# EAGLE design Sensly_HAT v1.6 (EAGLE 9.1.0)
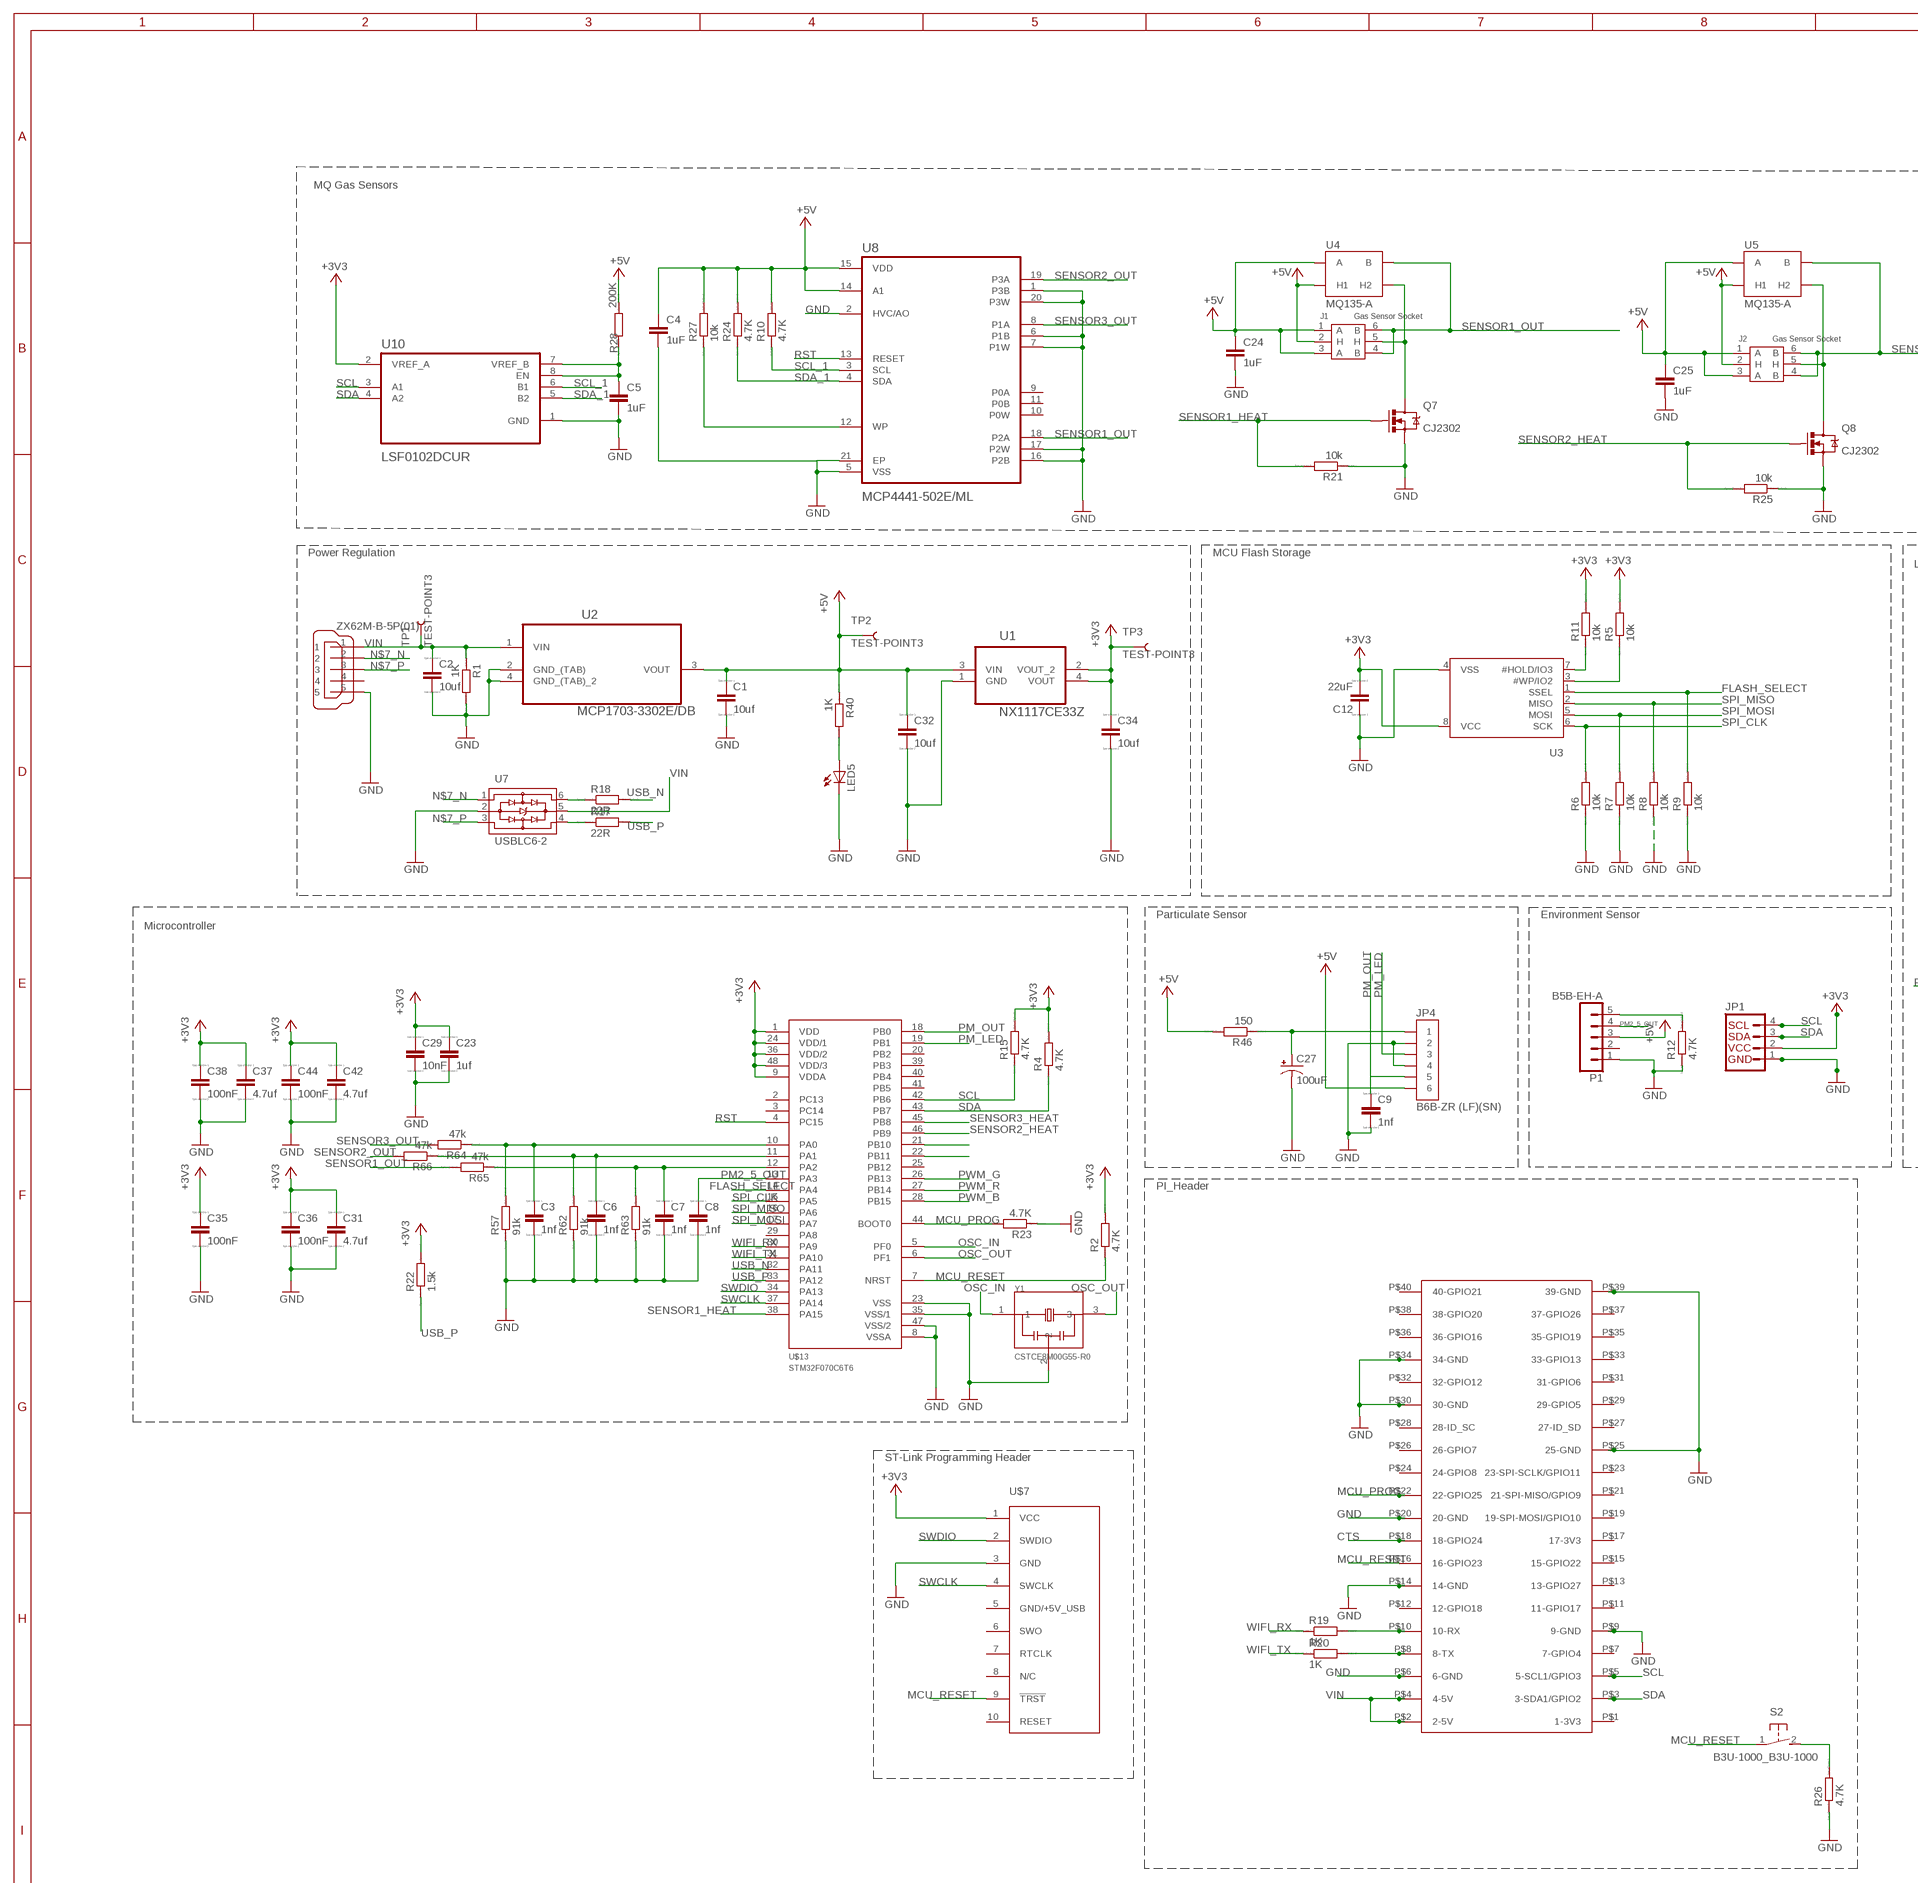
[diagram p0: schematic, sheet 1, part 1 of 2]
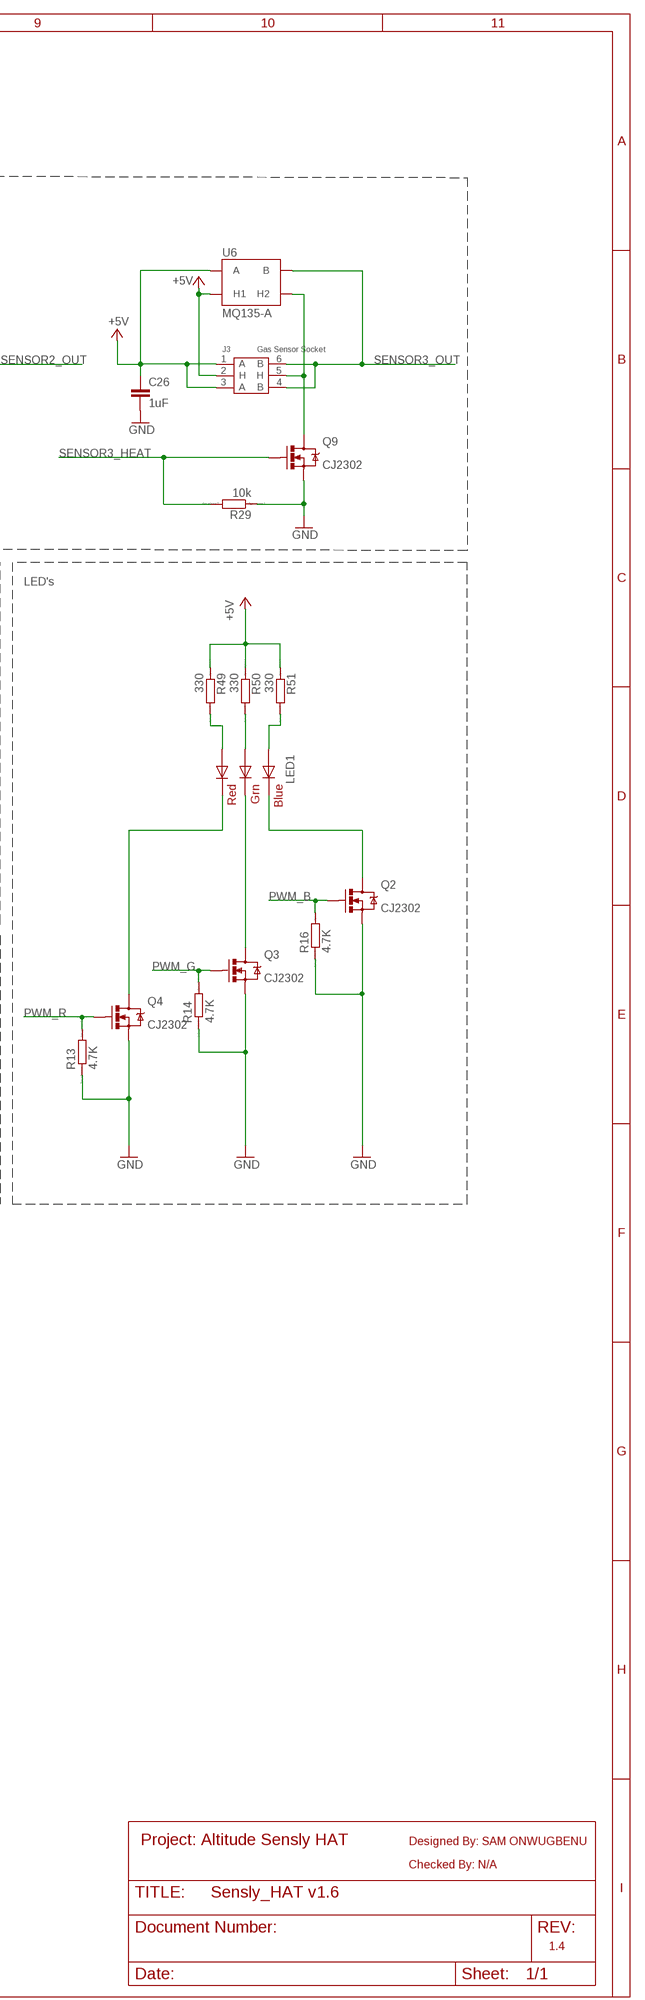
[diagram p1: schematic, sheet 1, part 2 of 2]

## Parts
C1  10uf  CC0603  [C0603]
C2  10uf  CC0603  [C0603]
C3  1nf  EAGLE-LTSPICE_CC0402  [EAGLE-LTSPICE_C0402]
C4  1uF  C0603  [0603_N]
C5  1uF  C0603  [0603_N]
C6  1nf  EAGLE-LTSPICE_CC0402  [EAGLE-LTSPICE_C0402]
C7  1nf  EAGLE-LTSPICE_CC0402  [EAGLE-LTSPICE_C0402]
C8  1nf  EAGLE-LTSPICE_CC0402  [EAGLE-LTSPICE_C0402]
C9  1nf  EAGLE-LTSPICE_CC0402  [EAGLE-LTSPICE_C0402]
C12  22uF  CC0603  [C0603]
C23  1uf  CC0603  [C0603]
C24  1uF  C0603  [0603_N]
C25  1uF  C0603  [0603_N]
C26  1uF  C0603  [0603_N]
C27  100uF  CAP_POL1206  [EIA3216]
C29  10nF  CC0603  [C0603]
C31  4.7uf  CC0603  [C0603]
C32  10uf  CC0603  [C0603]
C34  10uf  CC0603  [C0603]
C35  100nF  CC0603  [C0603]
C36  100nF  CC0603  [C0603]
C37  4.7uf  CC0603  [C0603]
C38  100nF  CC0603  [C0603]
C42  4.7uf  CC0603  [C0603]
C44  100nF  CC0603  [C0603]
J1  Gas Sensor Socket  MQ-SOCKET  [6P-D17.6X9.8H]
J2  Gas Sensor Socket  MQ-SOCKET  [6P-D17.6X9.8H]
J3  Gas Sensor Socket  MQ-SOCKET  [6P-D17.6X9.8H]
JP1  I2C_STANDARD  [1X04]
JP4  B6B-ZR (LF)(SN)  CONNECTOR_6X1-ZR-THT  [CONNECTOR_B6B-ZR]
LED1  RGBLED5050  [RGBLED5050]
LED5  LEDCHIPLED_0603  [CHIPLED_0603]
P1  B5B-EH-A  [B5B-EH-A]
Q2  CJ2302  MOSFET_N_SOT23-3  [SOT-23-3_N/SSOT-3_N]
Q3  CJ2302  MOSFET_N_SOT23-3  [SOT-23-3_N/SSOT-3_N]
Q4  CJ2302  MOSFET_N_SOT23-3  [SOT-23-3_N/SSOT-3_N]
Q7  CJ2302  MOSFET_N_SOT23-3  [SOT-23-3_N/SSOT-3_N]
Q8  CJ2302  MOSFET_N_SOT23-3  [SOT-23-3_N/SSOT-3_N]
Q9  CJ2302  MOSFET_N_SOT23-3  [SOT-23-3_N/SSOT-3_N]
R1  1K  RR0603  [R0603]
R2  4.7K  RR0603  [R0603]
R4  4.7K  RR0603  [R0603]
R5  10k  RR0603  [R0603]
R6  10k  RR0603  [R0603]
R7  10k  RR0603  [R0603]
R8  10k  RR0603  [R0603]
R9  10k  RR0603  [R0603]
R10  4.7K  RR0603  [R0603]
R11  10k  RR0603  [R0603]
R12  4.7K  RR0603  [R0603]
R13  4.7K  RR0603  [R0603]
R14  4.7K  RR0603  [R0603]
R15  4.7K  RR0603  [R0603]
R16  4.7K  RR0603  [R0603]
R17  22R  RR0603  [R0603]
R18  22R  RR0603  [R0603]
R19  1K  RR0603  [R0603]
R20  1K  RR0603  [R0603]
R21  10k  RR0603  [R0603]
R22  1.5k  RR0603  [R0603]
R23  4.7K  RR0603  [R0603]
R24  4.7K  RR0603  [R0603]
R25  10k  RR0603  [R0603]
R26  4.7K  RR0603  [R0603]
R27  10k  RR0603  [R0603]
R28  200K  RR0603  [R0603]
R29  10k  RR0603  [R0603]
R40  1K  RR0603  [R0603]
R46  150  RR0603  [R0603]
R49  330  RR0603  [R0603]
R50  330  RR0603  [R0603]
R51  330  RR0603  [R0603]
R57  91k  RR0603  [R0603]
R62  91k  RR0603  [R0603]
R63  91k  RR0603  [R0603]
R64  47k  RR0603  [R0603]
R65  47k  RR0603  [R0603]
R66  47k  RR0603  [R0603]
S2  B3U-1000_B3U-1000  [B3U-1000_B3U]
TP1  TEST-POINT3  [PAD.03X.03]
TP2  TEST-POINT3  [PAD.03X.03]
TP3  TEST-POINT3  [PAD.03X.03]
U1  NX1117CE33Z  [SOT230P700X180-4N]
U2  MCP1703-3302E/DB  [SOT230P700X180-4N]
U3  SPIFLASH_SOIC8  [SOIC8_150MIL]
U4  MQ135-A  [MQ135-A]
U5  MQ135-A  [MQ135-A]
U6  MQ135-A  [MQ135-A]
U7  USBLC6-2  [USBLC6-2P6]
U8  MCP4441-502E/ML  [QFN50P400X400X100-21N]
U10  LSF0102DCUR  [SOP50P310X90-8N]
U$2  RASPBERRY-PI+  [RASPBERRY-PI-PLUS-CAM_NOTCH]
U$7  TC2050-MCP-NL  [TC2030-MCP-NL]
U$9  ZX62M-B-5P(01)  [MICROUSB]
U$13  STM32F070C6T6  [QFP50P900X900X160-48N]
Y1  CSTCE8M00G55-R0  [OSC_CSTCE8M00G55-R0]

## Nets
+3V3: C12.2 C23.1 C29.1 C31.1 C34.1 C35.1 C36.1 C37.1 C38.1 C42.1 C44.1 JP1.2 R2.2 R4.2 R5.2 R11.2 R15.2 R22.2 TP3.P$1 U1.2(VOUT_2) U1.4(VOUT) U3.8(VCC) U10.2(VREF_A) U$7.1(VCC) U$13.1(VDD) U$13.9(VDDA) U$13.24(VDD/1) U$13.36(VDD/2) U$13.48(VDD/3)
+5V: C1.1 C4.1 C24.1 C25.1 C26.1 C32.1 J1.1(A) J1.2(H) J1.3(A) J2.1(A) J2.2(H) J2.3(A) J3.1(A) J3.2(H) J3.3(A) JP4.P$6 P1.3 R10.2 R24.2 R27.2 R28.2 R40.1 R46.2 R49.1 R50.1 R51.1 TP2.P$1 U1.3(VIN) U2.3(VOUT) U4.1(A) U4.2(H1) U4.3(A) U5.1(A) U5.2(H1) U5.3(A) U6.1(A) U6.2(H1) U6.3(A) U8.14(A1) U8.15(VDD)
CTS: U$2.P$18(18-GPIO24)
FLASH_SELECT: R9.2 U3.1(SSEL) U$13.14(PA4)
GND: C1.2 C2.2 C3.2 C4.2 C5.2 C6.2 C7.2 C8.2 C9.2 C12.1 C23.2 C24.2 C25.2 C26.2 C27.C(-) C29.2 C31.2 C32.2 C34.2 C35.2 C36.2 C37.2 C38.2 C42.2 C44.2 JP1.1 JP4.P$2 JP4.P$4 LED5.C P1.1 Q2.2(S) Q3.2(S) Q4.2(S) Q7.2(S) Q8.2(S) Q9.2(S) R1.2 R6.1 R7.1 R8.1 R9.1 R12.1 R13.1 R14.1 R16.1 R21.1 R23.1 R25.1 R26.1 R29.1 R57.1 R62.1 R63.1 U1.1(GND) U2.2(GND_(TAB)) U2.4(GND_(TAB)_2) U3.4(VSS) U7.2 U8.1(P3B) U8.2(HVC/AO) U8.5(VSS) U8.6(P1B) U8.7(P1W) U8.16(P2B) U8.17(P2W) U8.20(P3W) U8.21(EP) U10.1(GND) U$2.P$6(6-GND) U$2.P$9(9-GND) U$2.P$14(14-GND) U$2.P$20(20-GND) U$2.P$25(25-GND) U$2.P$30(30-GND) U$2.P$34(34-GND) U$2.P$39(39-GND) U$7.3(GND) U$9.5 U$13.8(VSSA) U$13.23(VSS) U$13.35(VSS/1) U$13.47(VSS/2) Y1.2
MCU_PROG: R23.2 U$2.P$22(22-GPIO25) U$13.44(BOOT0)
MCU_RESET: R2.1 S2.1 U$2.P$16(16-GPIO23) U$7.9(!TRST) U$13.7(NRST)
N$1: LED1.5(RED_C) Q4.3(D)
N$2: U$13.21(PB10)
N$3: U$13.22(PB11)
N$4: LED5.A R40.2
N$5: P1.5 R12.2
N$6: R26.2 S2.2
N$7_N: U7.1 U$9.2
N$7_P: U7.3 U$9.3
N$8: R19.2 U$2.P$10(10-RX)
N$9: R20.2 U$2.P$8(8-TX)
N$10: R27.1 U8.12(WP)
N$11: R5.1 U3.3(#WP/IO2)
N$12: C5.1 R28.1 U10.7(VREF_B) U10.8(EN)
N$12_N: R18.1 U7.6
N$12_P: R17.1 U7.4
N$13: R11.1 U3.7(#HOLD/IO3)
N$14: LED1.4(BLUE_C) Q2.3(D)
N$27: J1.5(H) Q7.3(D) U4.5(H2)
N$29: LED1.6(GREEN_C) Q3.3(D)
N$30: J2.5(H) Q8.3(D) U5.5(H2)
N$33: J3.5(H) Q9.3(D) U6.5(H2)
N$38: C27.A(+) JP4.P$1 R46.1
N$40: LED1.1(GREEN_A) R50.2
N$52: LED1.3(BLUE_A) R51.2
N$53: LED1.2(RED_A) R49.2
OSC_IN: U$13.5(PF0) Y1.1
OSC_OUT: U$13.6(PF1) Y1.3
PM2_5_OUT: C8.1 P1.4 U$13.13(PA3)
PM_LED: JP4.P$3 U$13.19(PB1)
PM_OUT: C9.1 JP4.P$5 U$13.18(PB0)
PWM_B: Q2.1(G) R16.2 U$13.28(PB15)
PWM_G: Q3.1(G) R14.2 U$13.26(PB13)
PWM_R: Q4.1(G) R13.2 U$13.27(PB14)
RST: U8.13(RESET) U$13.4(PC15)
SCL: JP1.4 R15.1 U10.3(A1) U$2.P$5(5-SCL1/GPIO3) U$13.42(PB6)
SCL_1: R10.1 U8.3(SCL) U10.6(B1)
SDA: JP1.3 R4.1 U10.4(A2) U$2.P$3(3-SDA1/GPIO2) U$13.43(PB7)
SDA_1: R24.1 U8.4(SDA) U10.5(B2)
SENSOR1_HEAT: Q7.1(G) R21.2 U$13.38(PA15)
SENSOR1_OUT: J1.4(B) J1.6(B) R65.2 U4.4(B) U4.6(B) U8.18(P2A)
SENSOR1_OUT1: C7.1 R63.2 R65.1 U$13.12(PA2)
SENSOR2_HEAT: Q8.1(G) R25.2 U$13.46(PB9)
SENSOR2_OUT: J2.4(B) J2.6(B) R66.2 U5.4(B) U5.6(B) U8.19(P3A)
SENSOR2_OUT1: C6.1 R62.2 R66.1 U$13.11(PA1)
SENSOR3_HEAT: Q9.1(G) R29.2 U$13.45(PB8)
SENSOR3_OUT: J3.4(B) J3.6(B) R64.2 U6.4(B) U6.6(B) U8.8(P1A)
SENSOR3_OUT1: C3.1 R57.2 R64.1 U$13.10(PA0)
SPI_CLK: R6.2 U3.6(SCK) U$13.15(PA5)
SPI_MISO: R8.2 U3.2(MISO) U$13.16(PA6)
SPI_MOSI: R7.2 U3.5(MOSI) U$13.17(PA7)
SWCLK: U$7.4(SWCLK) U$13.37(PA14)
SWDIO: U$7.2(SWDIO) U$13.34(PA13)
USB_N: R18.2 U$13.32(PA11)
USB_P: R17.2 R22.1 U$13.33(PA12)
VIN: C2.1 R1.1 TP1.P$1 U2.1(VIN) U7.5 U$2.P$2(2-5V) U$2.P$4(4-5V) U$9.1
WIFI_RX: R19.1 U$13.30(PA9)
WIFI_TX: R20.1 U$13.31(PA10)
Unconnected: P1.2 U8.9(P0A) U8.10(P0W) U8.11(P0B) U$2.P$1(1-3V3) U$2.P$7(7-GPIO4) U$2.P$11(11-GPIO17) U$2.P$12(12-GPIO18) U$2.P$13(13-GPIO27) U$2.P$15(15-GPIO22) U$2.P$17(17-3V3) U$2.P$19(19-SPI-MOSI/GPIO10) U$2.P$21(21-SPI-MISO/GPIO9) U$2.P$23(23-SPI-SCLK/GPIO11) U$2.P$24(24-GPIO8) U$2.P$26(26-GPIO7) U$2.P$27(27-ID_SD) U$2.P$28(28-ID_SC) U$2.P$29(29-GPIO5) U$2.P$31(31-GPIO6) U$2.P$32(32-GPIO12) U$2.P$33(33-GPIO13) U$2.P$35(35-GPIO19) U$2.P$36(36-GPIO16) U$2.P$37(37-GPIO26) U$2.P$38(38-GPIO20) U$2.P$40(40-GPIO21) U$7.5(GND/+5V_USB) U$7.6(SWO) U$7.7(RTCLK) U$7.8(N/C) U$7.10(RESET) U$9.4 U$13.2(PC13) U$13.3(PC14) U$13.20(PB2) U$13.25(PB12) U$13.29(PA8) U$13.39(PB3) U$13.40(PB4) U$13.41(PB5)

## Notes on the sheet
- MQ Gas Sensors
- Power Regulation | MCU Flash Storage
- LED's
- Particulate Sensor | Environment Sensor
- Microcontroller
- PI_Header
- ST-Link Programming Header
- Project: Altitude Sensly HAT | Designed By: SAM ONWUGBENU
- Checked By: N/A
- 1.4

## Library data of the parts
C1 C2 C12 C23 C29 C31 C32 C34-C38 C42 C44 = eagle-ltspice:C: CAPACITOR, European symbol; SPICEMODEL: NONE; SPICEPREFIX: C
C3 C6-C9 = pianywhere 4g:EAGLE-LTSPICE_C: CAPACITOR, European symbol; SPICEMODEL: NONE; SPICEPREFIX: C
C4 C5 C24-C26 = Xevelabs:C: Non-polarized Capacitor
C27 = SparkFun:CAP_POL: Capacitor Polarized These are standard SMD and PTH capacitors. Normally 10uF, 47uF, and 100uF in electrolytic and tantalum varieties. Always verify the external diameter of the through hole cap, it varies with capacity, voltage, and manufacturer. The EIA devices should be standard.
J1-J3 = template:MQ-SOCKET
JP1 = SparkFun-Connectors:I2C_STANDARD: SparkFun has standardized on a pinout for all I2C based sensor breakouts. This pinout allows I2C boards to be plugged directly into the headers on Arduino Uno compatible boards, and to be daisy chained easily.
JP4 = AirQuality-sensors:CONNECTOR_6X1
LED1 = adafruit:RGBLED: For 5050 RGB LEDs, the order of the LEDs may vary from one manufacturer to another!
LED5 = adafruit:LED: LED OSRAM: - CHIPLED LG R971, LG N971, LY N971, LG Q971, LY Q971, LO R971, LY R971 LH N974, LH R974 LS Q976, LO Q976, LY Q976 LO Q996 - Hyper CHIPLED LW Q18S LB Q993, LB Q99A, LB R99A - SideLED LS A670, LO A670, LY A670, LG A670, LP A670 LB A673, LV A673, LT A673, LW A673 LH A674 LY A675 LS A676, LA A676, LO A676, LY A676, LW A676 LS A679, LY A679, LG A679 - Hyper Micro SIDELED® LS Y876, LA Y876, LO Y876, LY Y876 LT Y87S - SmartLED LW L88C, LW L88S LB L89C, LB L89S, LG L890 LS L89K, LO L89K, LY L89K LS L896, LA L896, LO L896, LY L896 - TOPLED LS T670, LO T670, LY T670, LG T670, LP T670 LSG T670, LSP T670, LSY T670, LOP T670, LYG T670 LG T671, LOG T671, LSG T671 LB T673, LV T673, LT T673, LW T673 LH T674 LS T676, LA T676, LO T676, LY T676, LB T676, LH T676, LSB T676, LW T676 LB T67C, LV T67C, LT T67C, LS T67K, LO T67K, LY T67K, LW E67C LS E67B, LA E67B, LO E67B, LY E67B, LB E67C, LV E67C, LT E67C LW T67C LS T679, LY T679, LG T679 LS T770, LO T770, LY T770, LG T770, LP T770 LB T773, LV T773, LT T773, LW T773 LH T774 LS E675, LA E675, LY E675, LS T675 LS T776, LA T776, LO T776, LY T776, LB T776 LHGB T686 LT T68C, LB T68C - Hyper Mini TOPLED® LB M676 - Mini TOPLED Santana® LG M470 LS M47K, LO M47K, LY M47K Source: http://www.osram.convergy.de/
P1 = con-jst-eh:B5B-EH-A: HEADER
Q2-Q4 Q7-Q9 = Xevelabs:MOSFET_N
R1 R2 R4-R29 R40 R46 R49-R51 R57 R62-R66 = eagle-ltspice:R: RESISTOR, European symbol; SPICEMODEL: NONE; SPICEPREFIX: R
S2 = pianywhere 4g:B3U-1000_B3U-1000: Omron B3U-1000 SMD tact switch
TP1-TP3 = SparkFun-Passives:TEST-POINT: Bare copper test points for troubleshooting or ICT
U1 = sensly:NX1117CE33Z: LDO, FIXED, 3.3V, 1.25%, SOT-223-4; MPN: NX1117CE33Z; OC_FARNELL: 2057285; OC_NEWARK: unknown; PACKAGE: SOT-223-4; SUPPLIER: NXP
U2 = Microchip_By_element14_Batch_1:MCP1703-3302E/DB: IC REG LDO 3.3V 250MA; MPN: MCP1703-3302E/DB; OC_FARNELL: 1627177; OC_NEWARK: 40M0623; PACKAGE: SOT-223-3; SUPPLIER: Microchip
U3 = microbuilder:SPIFLASH_SOIC8: SOIC8 SPI Flash Be careful with the size since SOIC8 flash comes in several 'widths' SOIC8 150 mil M25P16 - 16Mbit (2Mbit x 8) Serial Flash (75MHz SPI Bus), Supply: 2.7-3.6V Digikey: SOIC8 - M25P16-VMN6P-ND SOIC8 208 mil W25Q16BVSSIG - 16Mbit (2Mbit x 8) Serial Flash (104MHz SPI Bus), Supply: 2.7-3.6V Digikey: SOIC8 - W25Q16BVSSIG-ND
U4-U6 = AirQuality-sensors:MQ135: MQ135 gas sensor
U7 = USBLC6-2:USBLC6-2; AVAILABILITY: Unavailable; DESCRIPTION: Very Low Capacitance Esd Protection; MF: STMicroelectronics; MP: USBLC6-2; PACKAGE: None; PRICE: None
U8 = MCP4441-502E_ML:MCP4441-502E/ML: None; AVAILABILITY: Warning; DESCRIPTION: MCP4441 Series Quad 7-Bit 129 Step I2C 5 kOhm Non Volatile Digital POT-QFN-20; MF: Microchip; MP: MCP4441-502E/ML; PACKAGE: QFN-20 Microchip; PRICE: 1.26 USD
U10 = LSF0102DCUR:LSF0102DCUR: None; AVAILABILITY: Good; DESCRIPTION: Dual Bidirectional Multi-Voltage Level Translator 8-US8 -40 to 125; MF: Texas Instruments; MP: LSF0102DCUR; PACKAGE: VFSOP-8 Texas Instruments; PRICE: 0.36 USD
U$2 = rpi-samtac:RASPBERRY-PI+: Samtec SSW-120-01-T-D
U$7 = TAG-Connect-TC2050-IDC-NL-SWD-Mode:TC2050: TAG-CONNECT ISP Connector Manufacturer: Tag-Connect <www.tag-connect.com> Cable for easy In-Circuit PCB Programming. Designed for JTAG 10 pin, suitable for many others. Pin Connection for TC2050 NL. PAD Description 1 VTREF 2 TMS 3 GND 4 TCK 5 NC 6 TDO 7 RTCK 8 TDI 9 !TRST 10 RESET ©2009 ROFA.cz Modified 7/2011 by Tim McCarthy-Smith VIDA Products INC
U$9 = usb:ZX62M-B-5P(01); FARNELL: 2427876
U$13 = STM32F070C6T6:STM32F070C6T6
Y1 = CSTCE8M00G55-R0:CSTCE8M00G55-R0: SMD Crystal 8MHz -0.3%-150R; AVAILABILITY: Good; DESCRIPTION: Ceramic Resonator 8MHz ??0.5% (Tol) ??0.2% (Stability) 33pF 40Ohm 3-Pin CSMD T/R; MF: Murata; MP: CSTCE8M00G55-R0; PACKAGE: SMD-3 Murata; PRICE: 0.27 USD

## Board
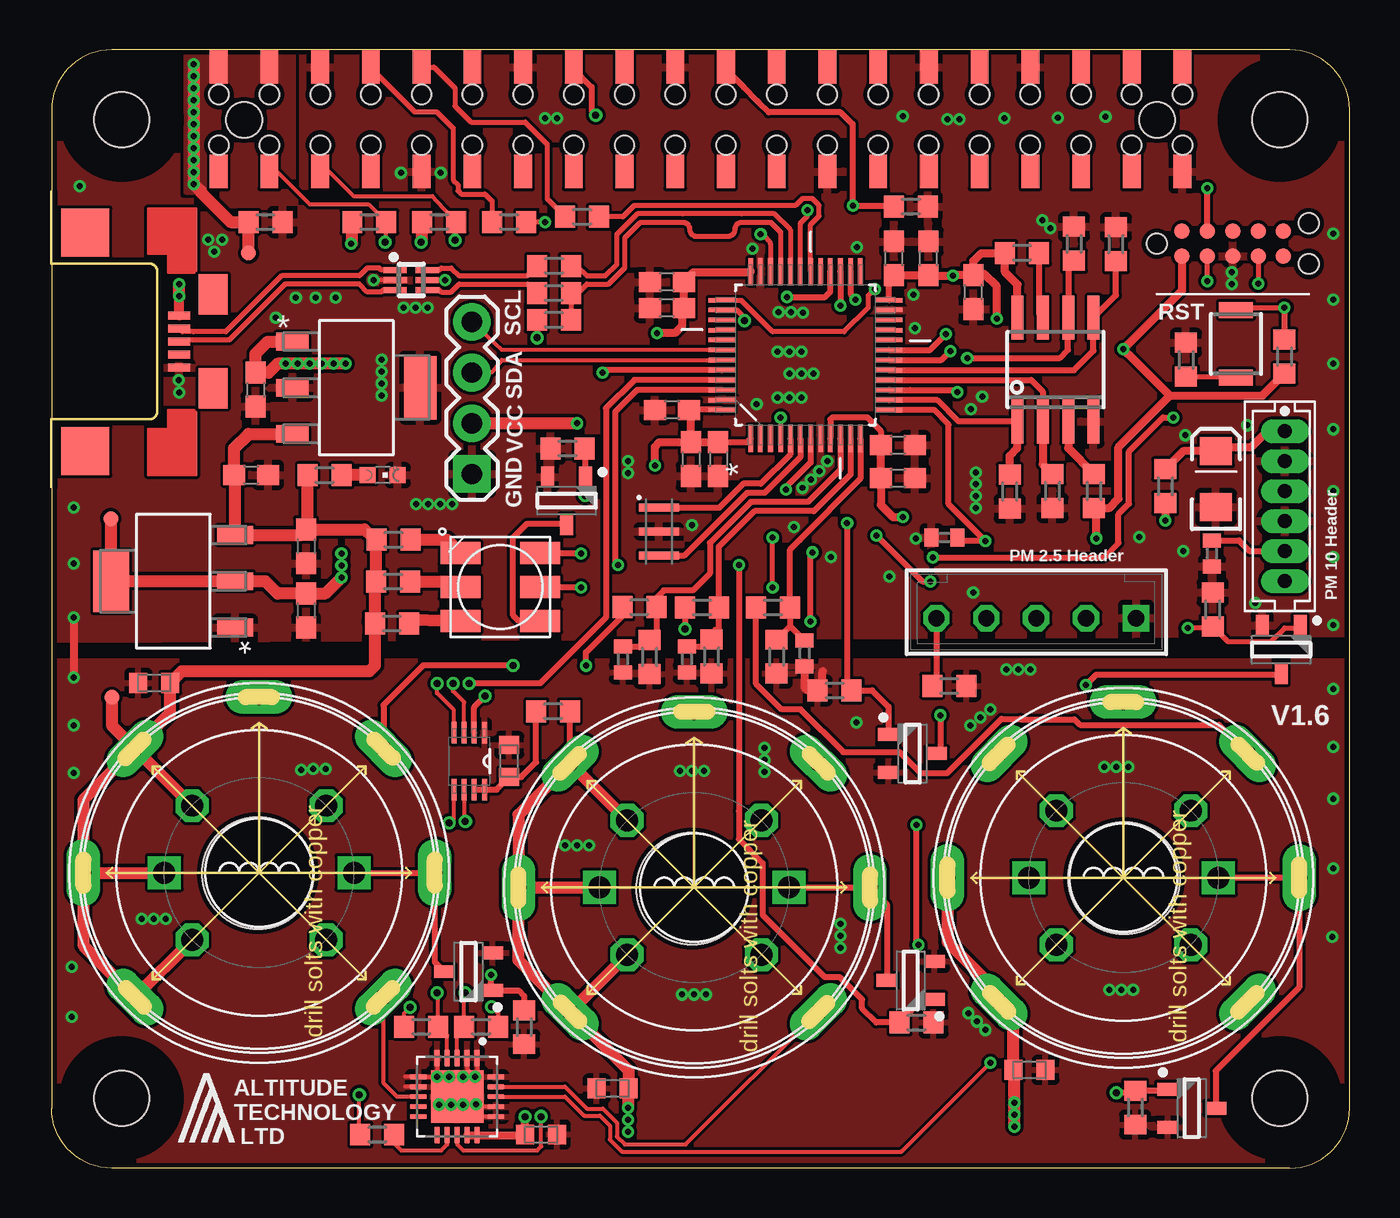
[diagram p2: board, top side]
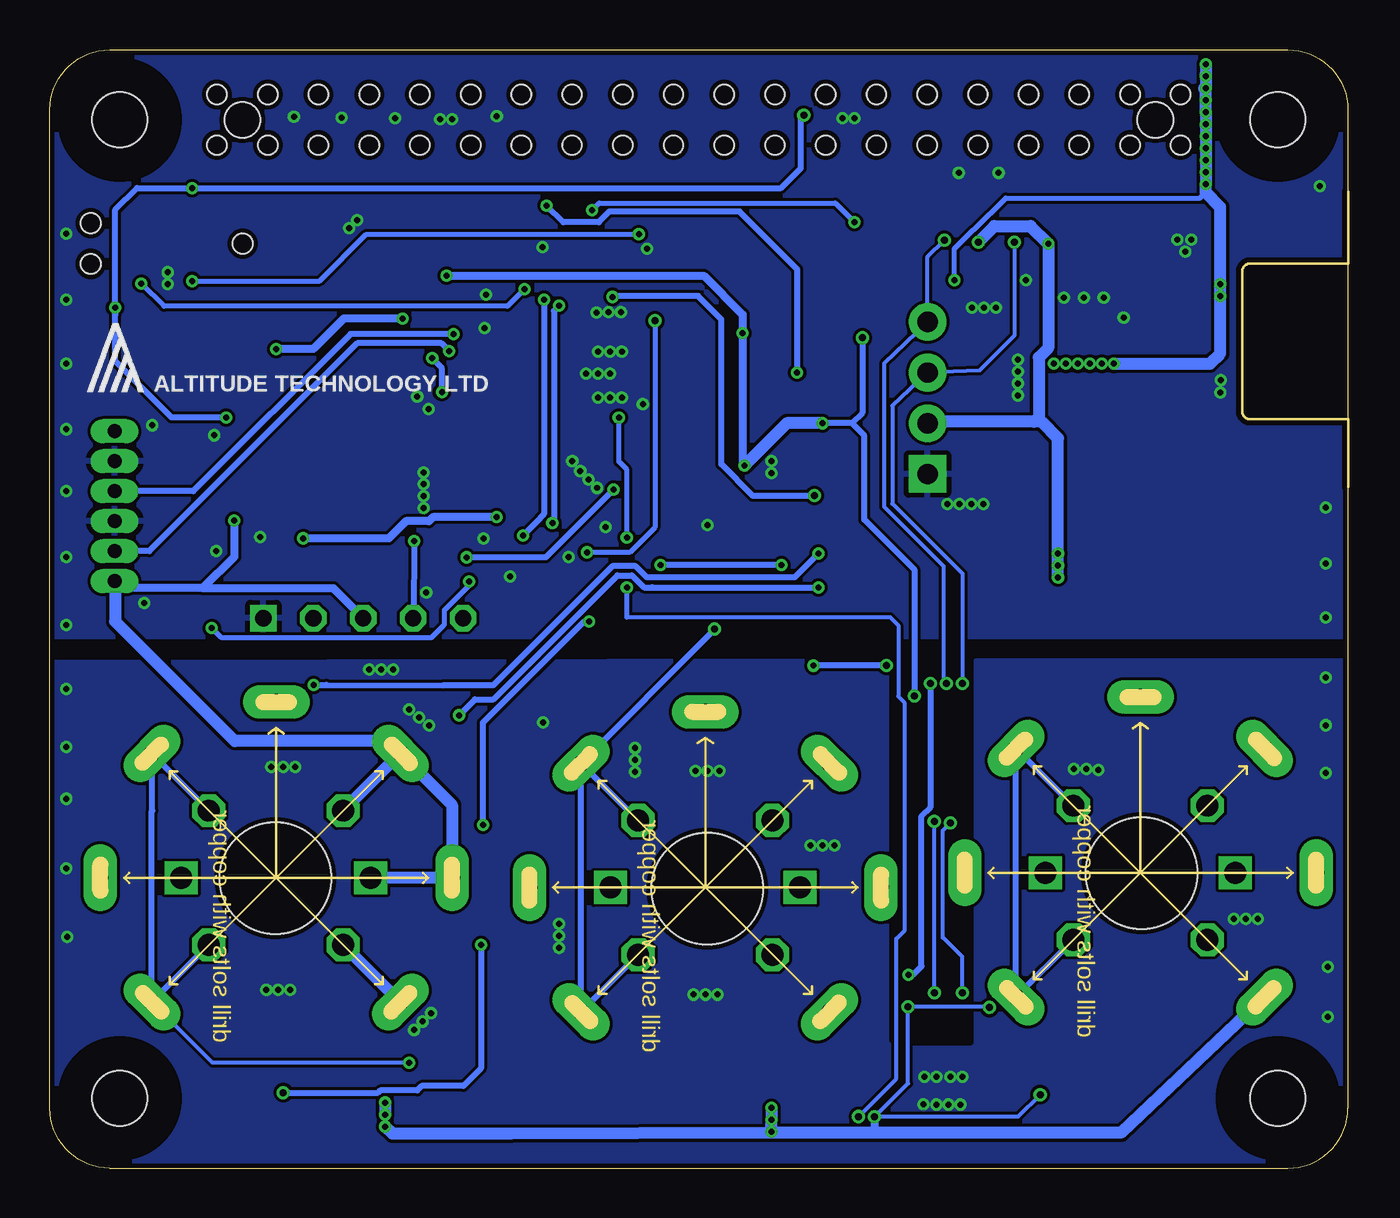
[diagram p3: board, bottom side, seen from below]

Size 65.01 x 56 mm. Coordinates in mm from the lower left corner, seen from the top.
Copper layers (1*16): Top 0.035mm / dielectric 1.5mm / Bottom 0.035mm
Design rules "SeeedStudio_2layer_DRU_no_angle_20140221 *": minimum track width 6mil, minimum drill 0.3mm, track to track 6mil, track to pad 6mil, pad to pad 6mil, via to via 6mil, smd to smd 0mil, copper to edge 10mil, drill to drill 10mil, minimum pad ring 10mil, minimum via ring 6mil, stop-mask expansion 2mil, vias tented up to drill 100mil, thermal gap 10mil
Holes 5.58 mm at 53.71,14.52 32.09,13.99 10.34,14.78

### Footprints (pad centres in the part's own frame; a part is rotated, then mirrored left to right if it is on the bottom)
C0603 = smd 1.1 x 1: 1 -0.85,0; 2 0.85,0
EAGLE-LTSPICE_C0402 = smd 0.7 x 0.9: 1 -0.65,0; 2 0.65,0
0603_N = smd 0.9 x 1: 1 -0.8,0; 2 0.8,0
EIA3216 = smd 1.4 x 1.6: A 1.4,0; C -1.4,0
6P-D17.6X9.8H = drill 0.8 pad 1.676 long: 1 -6.223,6.223; 2 0,8.8; 3 6.223,6.223; 4 6.223,-6.223; 5 0,-8.8; 6 -6.223,-6.223; 7 8.8,0
1X04 = drill 1.016 pad 1.88 square: 1 0,0 | drill 1.016 pad 1.88: 2 2.54,0; 3 5.08,0; 4 7.62,0
CONNECTOR_B6B-ZR = drill 0.7 pad 1.1 long: P$1 0,3.75; P$2 0,2.25; P$3 0,0.75; P$4 0,-0.75; P$5 0,-2.25; P$6 0,-3.75
RGBLED5050 = smd 2 x 1.1: 1 -2,1.7; 2 -2,0; 3 -2,-1.7; 4 2,-1.7; 5 2,0; 6 2,1.7
CHIPLED_0603 = smd 0.8 x 0.8: A 0,-0.75; C 0,0.75
B5B-EH-A = drill 0.813 square: 1 -5,0 | drill 0.813 octagon: 2 -2.5,0; 3 0,0; 4 2.5,0; 5 5,0
SOT-23-3_N/SSOT-3_N = smd 1.05 x 0.65: 1 -1.2,0.95; 2 -1.2,-0.95; 3 1.2,0
R0603 = smd 1 x 1.1: 1 -0.85,0; 2 0.85,0
B3U-1000_B3U = smd 0.8 x 1.7: 1 -1.7,0; 2 1.7,0
PAD.03X.03 = smd 0.762 x 0.762: P$1 0,0
SOT230P700X180-4N = smd 1.803 x 0.889: 1 -3.099,2.311; 2 -3.099,0; 3 -3.099,-2.311 | smd 1.803 x 3.099: 4 3.099,0
SOT230P700X180-4N' = smd 1.626 x 0.889: 1 -3.2,2.311; 2 -3.2,0; 3 -3.2,-2.311 | smd 1.626 x 3.175: 4 3.2,0
SOIC8_150MIL = smd 0.6 x 2.2: 1 -1.905,-2.6; 2 -0.635,-2.6; 3 0.635,-2.6; 4 1.905,-2.6; 5 1.905,2.6; 6 0.635,2.6; 7 -0.635,2.6; 8 -1.905,2.6
MQ135-A = drill 1.1 octagon: 1 -3.36,3.36; 3 -3.36,-3.36; 4 3.36,-3.36; 6 3.36,3.36 | drill 1.1 square: 2 -4.75,0; 5 4.75,0
USBLC6-2P6 = smd 0.3 x 1.16: 1 -0.5,-0.802; 2 0,-0.8; 3 0.5,-0.802; 4 0.5,0.802; 5 0,0.8; 6 -0.5,0.802
QFN50P400X400X100-21N = smd 0.84 x 0.26: 1 -1.935,1; 2 -1.935,0.5; 3 -1.935,0; 4 -1.935,-0.5; 5 -1.935,-1; 11 1.935,-1; 12 1.935,-0.5; 13 1.935,0; 14 1.935,0.5; 15 1.935,1 | smd 0.26 x 0.84: 6 -1,-1.935; 7 -0.5,-1.935; 8 0,-1.935; 9 0.5,-1.935; 10 1,-1.935; 16 1,1.935; 17 0.5,1.935; 18 0,1.935; 19 -0.5,1.935; 20 -1,1.935 | smd 2.63 x 2.63: 21 0,0
SOP50P310X90-8N = smd 1.067 x 0.254: 1 -1.422,0.762; 2 -1.422,0.254; 3 -1.422,-0.254; 4 -1.422,-0.762; 5 1.422,-0.762; 6 1.422,-0.254; 7 1.422,0.254; 8 1.422,0.762
RASPBERRY-PI-PLUS-CAM_NOTCH = smd 0.889 x 1.68: P$1 7.78,49.845; P$2 7.78,55.085; P$3 10.32,49.845; P$4 10.32,55.085; P$5 12.86,49.845; P$6 12.86,55.085; P$7 15.4,49.845; P$8 15.4,55.085; P$9 17.94,49.845; P$10 17.94,55.085; P$11 20.48,49.845; P$12 20.48,55.085; P$13 23.02,49.845; P$14 23.02,55.085; P$15 25.56,49.845; P$16 25.56,55.085; P$17 28.1,49.845; P$18 28.1,55.085; P$19 30.64,49.845; P$20 30.64,55.085; P$21 33.18,49.845; P$22 33.18,55.085; P$23 35.72,49.845; P$24 35.72,55.085; P$25 38.26,49.845; P$26 38.26,55.085; P$27 40.8,49.845; P$28 40.8,55.085; P$29 43.34,49.845; P$30 43.34,55.085; P$31 45.88,49.845; P$32 45.88,55.085; P$33 48.42,49.845; P$34 48.42,55.085; P$35 50.96,49.845; P$36 50.96,55.085; P$37 53.5,49.845; P$38 53.5,55.085; P$39 56.04,49.845; P$40 56.04,55.085 | hole 2.75: 2.91,52.44; 60.91,52.44; 2.91,3.44; 60.91,3.44 | hole 1.78: 9.05,52.44; 54.77,52.44 | hole 0.97: 7.78,53.71; 10.32,53.71; 12.86,53.71; 15.4,53.71; 17.94,53.71; 20.48,53.71; 23.02,53.71; 25.56,53.71; 28.1,53.71; 30.64,53.71; 33.18,53.71; 35.72,53.71; 38.26,53.71; 40.8,53.71; 43.34,53.71; 45.88,53.71; 48.42,53.71; 50.96,53.71; 53.5,53.71; 56.04,53.71; 7.78,51.17; 10.32,51.17; 12.86,51.17; 15.4,51.17; 17.94,51.17; 20.48,51.17; 23.02,51.17; 25.56,51.17; 28.1,51.17; 30.64,51.17; 33.18,51.17; 35.72,51.17; 38.26,51.17; 40.8,51.17; 43.34,51.17; 45.88,51.17; 48.42,51.17; 50.96,51.17; 53.5,51.17; 56.04,51.17
TC2030-MCP-NL = smd 0.787 x 0.787: 1 1.27,-0.635; 2 2.54,-0.635; 3 3.81,-0.635; 4 5.08,-0.635; 5 6.35,-0.635; 6 6.35,0.635; 7 5.08,0.635; 8 3.81,0.635; 9 2.54,0.635; 10 1.27,0.635 | hole 1: 0,0; 7.62,-1.016; 7.62,1.016
MICROUSB = smd 0.4 x 1.1: 1 -1.3,4.7; 2 -0.65,4.7; 3 0,4.7; 4 0.65,4.7; 5 1.3,4.7 | smd 2.4 x 2.4: P$6 5.5,0; P$7 -5.45,0 | smd 2 x 1.5: P$8 -2.35,6.4; P$9 2.35,6.4
QFP50P900X900X160-48N = smd 1.321 x 0.229: 1 -4.191,2.743; 2 -4.191,2.261; 3 -4.191,1.753; 4 -4.191,1.245; 5 -4.191,0.762; 6 -4.191,0.254; 7 -4.191,-0.254; 8 -4.191,-0.762; 9 -4.191,-1.245; 10 -4.191,-1.753; 11 -4.191,-2.261; 12 -4.191,-2.743; 25 4.191,-2.743; 26 4.191,-2.261; 27 4.191,-1.753; 28 4.191,-1.245; 29 4.191,-0.762; 30 4.191,-0.254; 31 4.191,0.254; 32 4.191,0.762; 33 4.191,1.245; 34 4.191,1.753; 35 4.191,2.261; 36 4.191,2.743 | smd 0.229 x 1.321: 13 -2.743,-4.191; 14 -2.261,-4.191; 15 -1.753,-4.191; 16 -1.245,-4.191; 17 -0.762,-4.191; 18 -0.254,-4.191; 19 0.254,-4.191; 20 0.762,-4.191; 21 1.245,-4.191; 22 1.753,-4.191; 23 2.261,-4.191; 24 2.743,-4.191; 37 2.743,4.191; 38 2.261,4.191; 39 1.753,4.191; 40 1.245,4.191; 41 0.762,4.191; 42 0.254,4.191; 43 -0.254,4.191; 44 -0.762,4.191; 45 -1.245,4.191; 46 -1.753,4.191; 47 -2.261,4.191; 48 -2.743,4.191
OSC_CSTCE8M00G55-R0 = smd 0.4 x 2: 1 -1.2,0; 2 0,0; 3 1.2,0

### Placement (x,y rotation side)
C1  10,34.71 0 top
C2  10.22,38.98 270 top
C3  28.62,25.48 270 top
C4  24.52,1.68 0 top
C5  22.92,20.38 90 top
C6  31.82,25.48 270 top
C7  37.72,25.78 270 top
C8  44.72,31.58 180 top
C9  58.12,30.78 270 top
C12  46.17,43.87 90 top
C23  42.39,36.21 0 top
C24  48.98,4.91 0 top
C25  28.1,3.99 180 top
C26  5.15,24.3 180 top
C27  58.32,34.5 90 top
C29  42.39,34.55 0 top
C31  30.82,44.38 180 top
C32  12.75,31.14 270 top
C34  12.75,27.92 270 top
C35  31.08,37.97 180 top
C36  30.82,43.08 180 top
C37  33.39,35.5 270 top
C38  32.02,35.5 270 top
C42  42.2,45.56 90 top
C44  43.93,45.56 90 top
J1  53.68,14.54 90 top
J2  32.19,14.05 90 top
J3  10.4,14.79 90 top
JP1  21.06,34.76 90 top
JP4  61.77,33.15 0 top
LED1  22.48,29.1 0 top
LED5  16.59,34.7 270 top
P1  49.32,27.54 180 top
Q2  25.8,33.42 270 top
Q3  61.58,25.97 270 top
Q4  43.12,20.76 0 top
Q7  57.1,3 0 top
Q8  43.03,9.4 180 top
Q9  20.88,9.84 180 top
R1  10.72,47.38 0 top
R2  61.75,40.64 270 top
R4  15.92,47.38 180 top
R5  52.21,33.91 270 top
R6  51.21,46.29 270 top
R7  53.31,46.27 270 top
R8  50.13,33.91 90 top
R9  47.99,33.88 90 top
R10  21.52,7.08 0 top
R11  48.61,45.83 180 top
R12  44.96,24.15 180 top
R13  39.22,23.92 0 top
R14  58.15,27.98 270 top
R15  19.42,47.38 180 top
R16  25.85,36.03 0 top
R17  25.16,43.82 0 top
R18  25.17,45.18 0 top
R19  26.57,47.64 180 top
R20  22.92,47.38 180 top
R21  54.28,3.03 90 top
R22  25.16,42.48 180 top
R23  43.04,48.15 180 top
R24  18.52,7.08 180 top
R25  43.32,7.29 180 top
R26  56.82,40.48 270 top
R27  16.32,1.68 180 top
R28  25.12,22.88 0 top
R29  23.68,7.06 90 top
R40  13.68,34.7 0 top
R46  55.78,34.15 270 top
R49  17.11,29.37 0 top
R50  17.13,31.47 0 top
R51  17.05,27.27 0 top
R57  29.95,25.6 90 top
R62  33.06,25.62 90 top
R63  36.32,25.61 90 top
R64  29.44,28.09 180 top
R65  36.14,28.08 180 top
R66  32.58,28.08 180 top
S2  59.32,41.28 270 top
TP1  9.87,45.83 0 top
TP2  3.02,23.58 0 top
TP3  2.97,32.53 0 top
U1  6.1,29.39 180 top
U2  MCP1703-3302E/DB  [SOT230P700X180-4N']  15.27,39.08 0 top
U3  50.28,39.99 0 top
U4  53.69,14.54 0 top
U5  32.19,14.05 0 top
U6  10.4,14.79 0 top
U7  18.02,44.48 270 top
U8  20.32,3.58 270 top
U10  20.92,20.38 270 top
U$2  0.6,0.06 0 top
U$7  55.35,46.3 0 top
U$9  1.7,41.4 270 top
U$13  37.76,40.72 90 top
Y1  30.42,31.88 270 top

### Tracks (layer width: path | path; a pad name or v marks a point on that pad's centre or on a via)
+3V3  (via drill 0.3, 0.35)
  Top 0.305: C23.1 41.54,36.92 40.85,37.61 39.13,37.61 39.01,37.49 U$13.9 | C37.1 34.84,36.35 U$13.1 | U$13.48 C35.1 | U$13.24 41.95,44.46 C42.1 | v24.32,41.58 R22.2 | U10.2 21.17,23.1 v21.72,23.65
  Top 0.406: 30.18,35.22 v30.22,35.18 30.22,36.12 30.45,36.35 C38.1 | 56.02,38.68 60.64,38.68 R2.2 | 56.02,38.68 53.95,40.75 53.94,40.75 v53.68,41.01 56.62,43.95 U$7.1 | R11.2 47.71,45.72 | 52.28,31.58 v52.32,31.54 52.32,32.95 R5.2 52.98,33.06 53.44,33.52 53.44,36.1 56.02,38.68 | C38.1 C37.1 | C38.1 32.02,37.88 C35.1 | C42.1 C44.1 43.95,44.69 v45.14,44.69 | v45.14,44.69 45.14,44.67 | U3.8 48.38,44.25 47.76,44.87 R11.2 | U$13.36 34.97,44.86 32.15,44.86 C31.1 C36.1 31.6,43.01 31.6,42.2 31.22,41.82 v30.32,41.82 | C12.2 45.17,44.72 v45.14,44.69 | C12.2 46.17,45.43 46.56,45.82 R11.2 | v47.34,42.55 47.34,44.16 46.72,44.78 46.23,44.78 C12.2 | C29.1 | C29.1 C23.1 | C29.1 41.54,33.21 42.15,32.6 v42.65,32.6
  Top 0.61: v14.52,29.58 13.72,28.78 C34.1 11.33,28.77 10.72,29.38 U1.2 U1.4 2.97,29.42 TP3.P$1 | v15.01,46.29 15.04,46.32 15.03,46.33 R4.2 | R15.2 v18.53,46.39 v18.52,46.38 | JP1.2 v26.32,37.3
  Bottom 0.305: v21.72,23.65 21.72,29.98 24.22,32.48 24.22,36.68 24.84,37.3 | 24.84,37.3 v26.32,37.3 | v24.32,41.58 24.32,37.82 24.84,37.3
  Bottom 0.406: 30.25,35.18 v30.22,35.18 30.32,35.28 v30.32,41.82 30.32,42.75 32.26,44.69 v45.14,44.69 | v47.34,42.55 50.29,42.55 51.82,41.02 v53.67,41.02 v53.68,41.01 | v52.32,31.54 48.04,31.54 47.18,32.4 46.03,32.4 45.83,32.6 v42.65,32.6
  Bottom 0.61: v14.52,29.58 v14.52,30.18 v14.52,30.78 14.52,36.54 15.36,37.38 15.72,37.38 | 30.2,35.2 v30.22,35.18 28.1,37.3 v26.32,37.3 | 15.72,37.38 21.04,37.38 JP1.2 | v18.52,46.38 17.72,47.18 15.9,47.18 v15.01,46.29 15.01,41.07 15.49,40.59 15.49,37.61 15.72,37.38
+5V  (via drill 0.3, 0.35)
  Top 0.203: R27.2 15.42,1.73 v15.42,3.68 | v22.04,8.09 22.37,7.75 R10.2 | R24.2 17.67,7.75 v17.96,8.04
  Top 0.254: 48.21,4.88 48.22,4.87
  Top 0.305: J2.3 R28.2
  Top 0.406: R46.2 v55.78,32.43 | v23.71,2.57 23.71,1.69 C4.1 23.69,1.65 U8.15 U8.14
  Top 0.61: C32.1 12.46,31.7 U1.3 9.2,34.76 C1.1 9.15,36.05 9.87,36.77 U2.3 | C32.1 15.66,31.99 R50.1 16.26,31.35 R49.1 16.2,29.31 R51.1 | R51.1 15.99,27.37 | C32.1 12.83,31.99 R40.1 | C25.1 28.91,4.17 | C25.1 28.88,3.97 v28.88,3.01 | 4.99,21.91 4.18,21.1 J3.3 | J3.3 1.6,18.43 J3.2 | J3.2 1.6,11.16 4.64,8.12 4.62,8.12 J3.1 U6.3 | TP2.P$1 3.02,22.17 J3.3 | J2.2 23.39,17.69 J2.3 U5.1 | J2.1 23.39,10.4 J2.2 | J2.1 28.9,4.9 C25.1 | J3.3 U6.1 | J3.2 U6.2 | U5.3 J2.1 | J2.2 U5.2 | R51.1 16.2,25.16 15.92,24.88 9.02,24.88 6.53,24.88 C26.1 5.95,22.78 J3.3 | 47.33,8.32 J1.1 | v48.22,2.08 v48.22,2.68 v48.22,3.28 48.22,4.87 C24.1 48.18,7.46 47.33,8.32 | J1.2 44.88,11.32 47.33,8.87 47.33,8.32
  Bottom 0.203: v15.42,3.68 16.53,2.57 v23.71,2.57 22.04,4.24 v22.04,8.08 | v22.04,8.08 v22.04,8.09 | v17.96,8.04 18,8.08 v22.04,8.08
  Bottom 0.406: P1.3 50.82,29.04 57.35,29.04 | 57.35,29.04 61.41,29.04 JP4.P$6 | v55.78,32.43 55.78,30.61 57.35,29.04 | v23.71,2.57 23.72,2.56 23.72,1.78
  Bottom 0.61: 28.88,1.78 29.12,1.78 41.91,1.72 47.86,1.72 v48.22,2.08 | v28.88,3.01 v28.88,2.41 v28.88,1.81 28.88,1.78 | 47.46,20.78 J1.3 | J3.1 11.36,1.78 23.72,1.78 28.88,1.78 | J1.3 44.88,18.18 J1.2 U4.2 | JP4.P$6 61.75,29.38 61.75,27.38 59.63,25.26 55.75,21.38 48.07,21.38 J1.3 | J1.1 U4.3 | J1.3 U4.1 | 47.57,20.88 J1.3 | v48.22,3.28 v48.22,2.68
FLASH_SELECT
  Top 0.305: 48.42,37.34 U3.1 45.43,37.39 44.36,38.46 U$13.14
  Top 0.406: R9.2 47.99,35.67 48.37,36.05 U3.1
GND  (via drill 0.3, 0.3 pad 0.41)
  Top 0.203: U7.2 v16.14,44.48 | v19.92,4.58 v20.62,4.58 | v20.62,3.18 v21.22,4.58 21.12,4.68 | v19.42,3.18 v20.02,3.18 | U8.5 v19.32,4.58 U8.6 17.72,4.58 | U8.2 20.82,4.98 21.12,4.68 | U8.1 21.32,4.88 21.12,4.68 | U8.7 17.72,4.08 | U8.17 21.38,3.08 | 21.38,3.08 v21.27,3.19 | U8.16 21.32,2.58 21.38,2.64 21.38,3.08
  Top 0.305: 53.27,47.08 R7.1
  Top 0.406: v1.12,27.58 v1.12,24.58 | C7.2 37.72,24.08 37.88,23.92 R13.1 38.62,24.17 38.62,24.88
  Bottom 0.203: v19.32,4.58 v19.92,4.58 | v20.62,4.58 v21.22,4.58 | v20.62,3.18 v20.02,3.18 v19.42,3.18
  other vias: 46.29,34.83 44.87,52.54 50.02,47.08 12.5,19.95 13.11,19.98 13.73,20 52.72,20.08 53.32,20.08 53.92,20.08 52.97,8.93 53.57,8.93 54.17,8.93 24.72,52.58 25.32,52.58 1.12,30.28 1.12,22.18 45.47,52.54 46.3,33.06 46.3,33.66 46.3,34.26 18.26,33.26 18.86,33.26 19.46,33.26 20.06,33.26 59.12,44.86 59.12,44.26 64.19,46.8 64.19,43.5 64.19,40.3 64.19,37 64.19,33.9 64.19,30.6 64.19,27.2 64.19,24 64.19,21.1 64.14,11.57 64.19,18.5 64.19,15 5.12,12.48 5.72,12.48 4.52,12.48 42.63,52.67 47.73,52.58 50.4,52.6 52.79,52.66 6.38,39.46 6.39,38.84 46.16,28.83 1.12,19.78 1.02,10.08 1.02,7.58 1.12,33.08 1.42,49.18 25.73,16.15 26.33,16.15 26.93,16.15 31.57,8.69 32.17,8.69 32.77,8.69 37.18,32.1 39.04,30.61 37.61,34.07 38.03,34.48 38.45,34.91 41.97,29.62 40.31,22.32 46.03,22.17 40.33,46.12 35.11,46.04 43.24,42.07 36.42,42.87 37.03,42.86 37.63,42.85 46.05,38.01 46.61,38.63 43.17,43.75 39.51,11.03 39.51,11.63 39.51,12.23 17.5,49.84 19.5,49.84 7.84,46.5 8.54,46.5 8.14,45.9 35.32,38.27 48.43,24.97 46.53,22.57 47.03,22.97 47.83,24.97 49.03,24.97 28.88,35.4 28.88,34.8 17.64,43.1 18.24,43.1 18.84,43.1 43.29,31.53 32.08,32.2 49.62,47.48 16.54,40.5 16.54,39.9 16.54,39.3 16.54,38.7 14.24,43.6 13.24,43.6 12.24,43.6 11.24,42.6 38.85,35.41 31.47,19.89 32.07,19.89 32.67,19.89 35.71,19.83 35.71,20.43 35.71,21.03 56.69,30.9 54.49,31.6 56.79,36.7 59.89,37.2 60.29,28.3 46.77,6.91 46.35,7.34 45.92,7.76 36.37,40.89 36.97,40.89 37.57,40.89 36.97,39.79 37.57,39.79 38.17,39.79 36.37,38.59 36.97,38.59 37.57,38.59
  pour Top (rank 4): 0.12,26.48 -0.24,53.03 arc-91 2.77,56.08 62.02,55.98 arc-90 65.02,52.98 65.02,26.78
  pour Bottom (rank 4): -0.11,26.66 -0.26,53.06 arc-90 2.74,56.08 62.03,55.98 arc-90 65.03,52.99 65.09,26.66
  pour Top (rank 4): 65.09,25.37 0.08,25.37 0.12,2.91 arc90 3.12,-0.08 62.13,-0.08 arc90 65.13,2.93
  pour Bottom: 0.12,25.3 0.2,25.38 18.62,25.38 18.62,6.18 18.82,5.98 22.82,5.98 23.12,6.28 23.12,25.38 65.13,25.3 65.13,2.92 arc-90 62.13,-0.08 3.12,-0.08 arc-90 0.12,2.92
MCU_PROG  (via drill 0.3)
  Top 0.305: v27.59,39.84 27.71,39.96 U$13.44 | R23.2 41.95,48.21 v40.14,48.21 40.12,48.23 40.12,52.28 39.52,52.88 35.92,52.88 35.42,53.38 35.32,53.48 34.67,54.13 34.67,54.14 33.78,55.03 U$2.P$22
  Bottom 0.305: v27.59,39.84 27.59,45.02 30.47,47.9 37,47.9 37.5,47.4 37.5,47.39 37.52,47.37 39.3,47.37 v40.14,48.21
MCU_RESET  (via drill 0.3, 0.35)
  Top 0.254: S2.1 59.44,43.1 v61.75,43.1
  Top 0.305: v61.75,43.1 R2.1 | v44.14,30.59 52.72,30.59 53.44,31.31 53.44,32.75 53.96,33.27 53.96,35.89 55.66,37.59 v56.18,37.59 | U$7.9 v57.88,49.08 | U$2.P$16 26.16,55.03 27.05,54.14 27.05,52.94 v27.26,52.73 | U$13.7 38.01,35.33 37,34.32 36.8,34.1 v36.79,33.98
  Bottom 0.305: v56.18,37.59 58.92,37.59 61.75,40.42 v61.75,43.1 61.73,42.72 61.73,48 60.65,49.08 v57.88,49.08 28.39,49.08 27.4,50.07 27.4,52.58 v27.26,52.72 v27.26,52.73 | v44.14,30.59 40.18,30.59 v36.79,33.98
N$1  (via drill 0.3)
  Top 0.305: LED1.5 26.5,29.1 v26.52,29.08 | v44.52,22.68 44.52,20.96 Q4.3
  Bottom 0.305: v44.52,22.68 43.72,23.48 42.8,23.48 36.59,29.69 35.87,29.69 35.26,29.08 34.87,29.08 34.82,29.08 v26.52,29.08
N$4
  Top 0.61: LED5.A R40.2
N$5
  Top 0.305: P1.5 44.32,24.36 R12.2
N$6
  Top 0.254: R26.2 59.27,39.63 S2.2
N$7_N
  Top 0.254: U7.1 16.52,44.98 16.42,45.08 15.82,45.08 15.42,44.68 11.54,44.68 8.74,41.88 7.12,41.88 6.57,41.88 U$9.2
N$7_P
  Top 0.254: U7.3 16.62,43.98 16.52,43.88 15.82,43.88 15.42,44.28 11.7,44.28 8.9,41.48 7.12,41.48 6.48,41.48 U$9.3
N$8
  Top 0.254: U$2.P$10 19.16,55.14 20.21,54.09 20.21,53.19 21.02,52.38 23.72,52.38 24.82,51.28 24.82,48.54 R19.2
N$9
  Top 0.254: U$2.P$8 16,55.09 18.18,52.9 19.3,52.9 20.12,52.08 20.12,49.48 20.36,49.24 20.36,48.95 20.52,48.79 21.71,48.79 22.07,48.43 R20.2
N$10
  Top 0.203: U8.12 19.82,1.18 19.52,0.88 17.52,0.88 17.17,1.23 R27.1
N$11
  Top 0.406: U3.3 50.91,36.05 R5.1
N$12
  Top 0.305: U10.7 U10.8 22.3,18.96 C5.1 23.52,19.58 24.27,20.33 R28.1
N$12_N
  Top 0.254: U7.6 19.42,44.98 19.52,45.08 20.02,45.08 20.42,44.68 23.12,44.68 23.82,44.68 R18.1
N$12_P
  Top 0.254: U7.4 19.42,43.98 19.52,43.88 20.02,43.88 20.42,44.28 23.85,44.28 R17.1
N$13
  Top 0.305: R11.1 49.46,42.77 U3.7
N$14
  Top 0.305: 24.52,27.36 LED1.4 23.4,27.4 23.12,27.68 23.12,31.58 23.82,32.28 25.74,32.28 Q2.3
N$27
  Top 0.305: Q7.3 58.3,4.86 62.48,9.04 J1.5 U4.5
N$29  (via drill 0.3)
  Top 0.305: LED1.6 26.5,30.8 v26.52,30.78 | v51.81,24.2 52.32,24.71 61.52,24.71 Q3.3
  Bottom 0.305: v51.81,24.2 51.17,24.2 45.32,24.18 42.81,24.18 38.86,28.12 38.71,28.28 36.85,30.14 35.68,30.14 35.11,29.58 27.72,29.58 v26.52,30.78 26.67,30.78
N$30
  Top 0.305: 41.34,13.7 J2.5 | U5.5 J2.5 | J2.5 41.83,13.21 Q8.3
N$33
  Top 0.305: U6.5 J3.5 19.2,10.32 Q9.3
N$38
  Top 0.406: C27.A 58.36,35.86 58.65,35.86 58.91,36.12 60.1,36.12 60.88,36.9 JP4.P$1 | 58.13,36.09 C27.A | C27.A 56.68,35.9 R46.1
N$40
  Top 0.61: R50.2 19.81,31.47 LED1.1
N$52
  Top 0.61: R51.2 18.05,27.47 LED1.3
N$53
  Top 0.61: R49.2 20.21,29.37 LED1.2
OSC_IN
  Top 0.305: U$13.5 37,35.74 35.53,34.27 34.64,34.27 33.45,33.08 Y1.1
OSC_OUT
  Top 0.305: U$13.6 37.51,35.6 35.72,33.82 34.83,33.82 31.7,30.68 Y1.3
PM2_5_OUT  (via drill 0.3)
  Top 0.305: U$13.13 44.18,37.98 44.93,37.23 44.93,33.25 v46.78,31.4 45.55,31.4 C8.1
  Bottom 0.305: v46.78,31.4 46.8,27.56 P1.4
PM_LED  (via drill 0.3)
  Top 0.305: U$13.19 43.99,40.97 v44.79,41.77
  Bottom 0.305: v44.79,41.77 49.96,41.77 57.83,33.9 JP4.P$3
PM_OUT  (via drill 0.3)
  Top 0.305: U$13.18 44.57,40.47 v45.02,40.92 | C9.1 59.47,31.43 60.02,30.88 60.04,30.9 JP4.P$5
  Bottom 0.305: v45.03,40.92 v45.02,40.92 v45.02,40.93 45.4,41.31 49.62,41.31 60.03,30.9 JP4.P$5
PWM_B  (via drill 0.3, 0.35)
  Top 0.305: U$13.28 39,43.89 38.74,43.63 v36.84,43.63 | v26.72,33.68 26.72,34.59 Q2.1 26.75,35.98 R16.2
  Bottom 0.305: v36.84,43.63 36.8,43.67 32.55,43.67 31.38,42.5 31.38,35.27 31.39,35.26 31.39,35.25 29.82,33.68 v26.72,33.68
PWM_G  (via drill 0.3)
  Top 0.254: v56.9,27.04 58.06,27.04 R14.2 58.91,26.37 61.07,26.37 61.75,27.05 62.53,27.05
  Top 0.305: U$13.26 40.02,43.78 v40.27,43.5 | 62.53,27.05 Q3.1 | v41.32,31.68 43.62,29.38 v44.02,29.38
  Bottom 0.254: v56.9,27.04 56.44,26.58 45.89,26.58 45.26,27.21 45.26,27.93 44.02,29.17 v44.02,29.38
  Bottom 0.305: v41.32,31.68 40.46,32.54 40.46,32.56 40.27,32.75 v40.27,43.5
PWM_R  (via drill 0.3)
  Top 0.305: 41.76,21.87 Q4.1 41.92,23.1 41.1,23.92 R13.2 | U$13.27 v39.51,43.19 | 40.36,23.9 R13.2 | R13.2 39.85,24.14 v39.85,32.31
  Bottom 0.305: v39.51,43.19 39.77,42.93 39.77,32.39 v39.85,32.31
RST  (via drill 0.3, 0.35)
  Top 0.203: U8.13 20.32,1.18 20.62,0.88 24.32,0.88 24.52,1.08 v24.52,2.58
  Top 0.254: v36.12,29.08 v36.12,31.58 | v36.52,37.58 v36.52,37.57 U$13.4
  Bottom 0.203: v24.52,2.58 22.62,4.48 22.62,11.48 22.22,11.88 22.22,23.33 22.52,23.63 22.52,27.18 22.92,27.58 36.12,27.58
  Bottom 0.254: 36.12,27.58 v36.12,29.08 | v36.12,31.58 36.12,34.98 36.52,35.38 v36.52,37.58
SCL  (via drill 0.35)
  Top 0.203: U$13.42 22.57,40.97 JP1.4 | U$2.P$5 13.89,49.91 15.12,48.68 19.06,48.68 R15.1 | v20.11,24.28 20.11,23.89 20.67,23.33 U10.3
  Top 0.254: R15.1 20.22,47.41 v20.22,46.48
  Bottom 0.203: v20.22,46.48 21.06,45.64 JP1.4 23.23,40.31 23.23,33.11 20.26,30.14 20.26,24.42 v20.11,24.28
SCL_1  (via drill 0.35)
  Top 0.203: v20.72,8.78 20.67,8.73 R10.1 20.32,6.73 U8.3 | U10.6 20.67,17.42 v20.73,17.36
  Bottom 0.203: v20.73,17.36 v20.72,17.36 v20.72,8.78
SDA  (via drill 0.35)
  Top 0.203: U$13.43 22.57,40.47 22.06,39.86 21.08,39.86 JP1.3 | U$2.P$3 11.29,49.91 12.93,48.27 15.88,48.27 R4.1 v16.73,46.39 | v19.31,24.28 19.31,23.79 20.16,22.94 U10.4
  Top 0.254: v16.73,46.39 v16.72,46.38
  Bottom 0.203: v16.72,46.38 16.72,41.68 18.46,39.94 JP1.3 22.82,38.18 22.82,33.28 19.31,29.77 v19.31,24.28
SDA_1  (via drill 0.35)
  Top 0.203: v19.32,8.78 19.37,8.73 R24.1 19.82,6.63 U8.4 | v19.92,17.28 20.14,17.51 20.14,17.61 20.16,17.62 U10.5
  Bottom 0.203: v19.32,8.78 19.32,10.58 20.29,11.55 20.29,16.91 v19.92,17.28
SENSOR1_HEAT  (via drill 0.3, 0.35)
  Top 0.254: v34.71,42.43 34.71,42.59 34.32,42.98 U$13.38
  Top 0.305: v38.12,30.84 38.02,30.74 v38.02,27.37 | Q7.1 55.83,3.88 R21.2 54.18,3.78 v53.32,3.78 | v43.42,11.18 43.32,11.28 v43.32,17.18 43.32,17.28
  Bottom 0.254: v34.71,42.43 34.71,32.09 35.96,30.84 v38.12,30.84
  Bottom 0.305: v53.32,3.78 48.58,3.78 48.47,3.89 46.61,3.89 46.39,4.11 44.3,4.11 43.42,4.99 v43.42,11.18 | v43.32,17.18 43.32,22.31 38.26,27.37 v38.02,27.37
SENSOR1_OUT  (via drill 0.3)
  Top 0.203: U8.18 25.72,3.58 26.67,2.62 27.47,2.62 27.97,2.13 27.97,1.43 28.42,0.98 28.58,0.82 42.56,0.82 v47.02,5.28
  Top 0.305: R65.2 35.29,24.25 36.57,22.97 37.52,22.97 39.66,20.83 42.47,20.83 43.52,19.78 44.86,19.78 47.58,22.5 48.52,22.5 48.54,22.48 51.22,22.48 51.5,22.2 58.47,22.2 J1.4
  Bottom 0.203: v47.02,5.28 56.86,5.28 J1.6
  Bottom 0.305: 59.9,17.88 J1.4 U4.6 | 59.9,17.88 J1.6 U4.4 | 59.88,17.9 59.9,17.88
SENSOR1_OUT1
  Top 0.305: U$13.12 40.5,34.52 37.47,31.45 36.99,30.97 R65.1 36.99,27.16 | 36.99,27.16 C7.1 | R63.2 36.99,27.13 36.99,27.16
SENSOR2_HEAT  (via drill 0.3)
  Top 0.254: R25.2 42.62,7.44
  Top 0.305: v34.44,30.2 34.44,17.9 34.42,17.88 34.42,16.48 35.62,15.28 35.62,12.68 38.74,9.56 39.48,9.56 40.59,8.45 40.59,8.01 41.31,7.29 R25.2 43.63,8.45 Q8.1 44.37,8.31 | U$13.46 29.33,38.97 28.23,37.86 28.23,30.35 v28.38,30.2
  Bottom 0.305: v28.38,30.2 v34.44,30.2
SENSOR2_OUT  (via drill 0.35)
  Top 0.203: U8.19 25.72,4.08 26.82,2.98 27.62,2.98 28.32,2.28 28.32,1.58 28.72,1.18 31.77,1.18 J2.6
  Top 0.305: R66.2 v31.73,27
  Bottom 0.305: J2.4 J2.6 U5.4 | U5.6 J2.4 | J2.4 31.89,26.79 31.89,26.83 v31.73,27
SENSOR2_OUT1
  Top 0.305: U$13.11 40.02,34.74 38.18,32.9 35.21,32.9 33.43,31.12 R66.1 33.43,26.84 R62.2 | 33.25,26.95 R62.2 | C6.1 32.72,26.13 R62.2
SENSOR3_HEAT  (via drill 0.3, 0.35)
  Top 0.305: U$13.45 29.2,39.48 27.77,38.05 27.77,27.57 24.48,24.28 v20.92,24.28 | Q9.1 | Q9.1 21.71,8.89 | Q9.1 22.02,8.95 v22.02,9.68 | R29.2 23.68,8.62 23.41,8.89 Q9.1
  Bottom 0.305: v20.92,24.28 20.92,18.06 21.36,17.63 21.36,10.11 21.79,9.68 v22.02,9.68
SENSOR3_OUT  (via drill 0.3, 0.35)
  Top 0.203: U8.8 17.32,3.58 16.62,4.28 J3.6
  Top 0.305: v23.12,25.17 18.61,25.17 16.62,23.18 J3.4 | v26.77,25.16 26.77,25.83 28.59,27.65 R64.2
  Bottom 0.305: v23.12,25.17 v26.77,25.16 | U6.6 J3.4 J3.6 U6.4
SENSOR3_OUT1
  Top 0.305: U$13.10 39.51,34.99 37.88,33.36 35.02,33.36 32.97,31.31 32.97,29.78 32.13,28.93 30.68,28.93 30.29,28.55 R64.1 30.29,26.79 R57.2 29.63,26.13 C3.1
SPI_CLK  (via drill 0.3)
  Top 0.305: 50.91,45.14 51.38,45.14 51.42,45.18 | 50.9,41.92 50.93,41.95 50.93,42.57 U3.6 | U3.6 50.91,41.67 | U$13.15 42.99,38.97 45.27,38.97 v45.38,38.86 | R6.2 50.91,45.14 | 50.91,45.14 U3.6 | v45.86,40.57 50.5,40.57 50.91,40.98 U3.6
  Bottom 0.305: v45.38,38.86 45.38,40.06 v45.86,40.57
SPI_MISO
  Top 0.305: U3.2 49.65,38.9 49.07,39.48 U$13.16
  Top 0.406: U3.2 49.64,35.24 R8.2
SPI_MOSI
  Top 0.305: 43.01,39.94 U$13.17 51.21,39.96 52.18,40.93 U3.5 53.31,43.71 R7.2
SWCLK  (via drill 0.3)
  Top 0.254: v41.23,44.03 40.89,43.7 40.89,43.08 39.69,41.88 36.12,41.88 34.54,43.46 U$13.37 | U$7.4 v60.43,44.3
  Bottom 0.254: v41.23,44.03 42.1,43.16 59.29,43.16 v60.43,44.3
SWDIO  (via drill 0.3)
  Top 0.254: 57.89,45.88 U$7.2 v57.89,44.43 | U$13.34 36,46.31 35.64,46.77 v35.52,46.77
  Bottom 0.254: v35.52,46.77 49.17,46.77 51.51,44.43 v57.89,44.43
USB_N
  Top 0.254: U$13.32 37,46.99 36.19,47.79 34.57,47.79 31.62,47.79 29.35,47.79 28.32,46.76 28.32,45.26 27.74,44.68 26.82,44.68 26.32,45.18 R18.2
USB_P
  Top 0.152: 36.49,46.9 36.52,46.88
  Top 0.254: 36.52,46.88 U$13.33 | 36.49,46.9 36.49,46.91 36.04,47.36 34.57,47.36 arc90 34.22,47.01 arc-90 33.87,46.66 32.32,46.66 arc-90 31.97,47.01 arc90 31.62,47.36 29.49,47.36 28.72,46.6 28.72,45.1 27.9,44.28 26.82,44.28 26.36,43.82 R17.2 R22.1
VIN  (via drill 0.3)
  Top 0.254: U7.5 v19.72,44.48
  Top 0.406: v6.4,43.66 6.4,43.68
  Top 0.508: U$9.1 v6.4,43.66
  Top 0.61: v14.73,40.28 v14.13,40.28 v13.53,40.28 v12.93,40.28 v12.33,40.28 v11.73,40.28 11.32,40.28 10.87,39.83 C2.1 10.22,40.78 10.83,41.39 U2.1 | v7.13,55.28 v7.13,49.28 7.48,48.93 7.48,48.88 8.97,47.38 R1.1 TP1.P$1 | v6.4,43.66 v6.4,44.26
  Bottom 0.254: v19.72,44.48 19.72,46.04 18.77,46.99 18.74,46.99 17.15,48.58 7.41,48.58 7.13,48.86
  Bottom 0.61: v7.13,55.28 7.13,54.79 7.12,54.78 | v7.13,54.68 7.13,54.17 7.22,54.08 | 7.12,50.38 7.12,52.18 7.13,52.19 v7.13,52.88 v7.13,53.48 v7.13,54.08 | v7.13,49.88 v7.13,49.27 | v7.13,50.48 v7.13,49.89 | v7.13,49.28 7.13,48.86 6.4,48.13 v6.4,43.66 6.4,40.8 6.92,40.28 v11.73,40.28
  other vias: 7.13,51.08 7.13,51.68 7.13,52.28
  pour Top (no thermals): 12.12,56.08 6.72,56.08 6.72,48.88 12.12,48.88
WIFI_RX
  Top 0.254: U$13.30 38.01,47.25 38.44,47.67 38.44,48.22 38.1,48.56 37.62,48.56 37.26,48.2 29.18,48.2 28.62,47.64 R19.1
WIFI_TX  (via drill 0.3)
  Top 0.254: U$13.31 37.51,47.31 37.86,47.67 v37.86,47.98 | v24.72,47.38 R20.1
  Bottom 0.254: v37.86,47.98 37.5,48.33 25.67,48.33 v24.72,47.38

### Text on the board
tPlace: RST | PM 10 Header | ALTITUDE / TECHNOLOGY / LTD
bPlace: ALTITUDE TECHNOLOGY LTD
tNames: SCL | SDA | VCC | GND | PM 2.5 Header | V1.6